# EAGLE schematic stm32f303 (EAGLE 7.7.0)

## Sheet 1 of 3: Controller
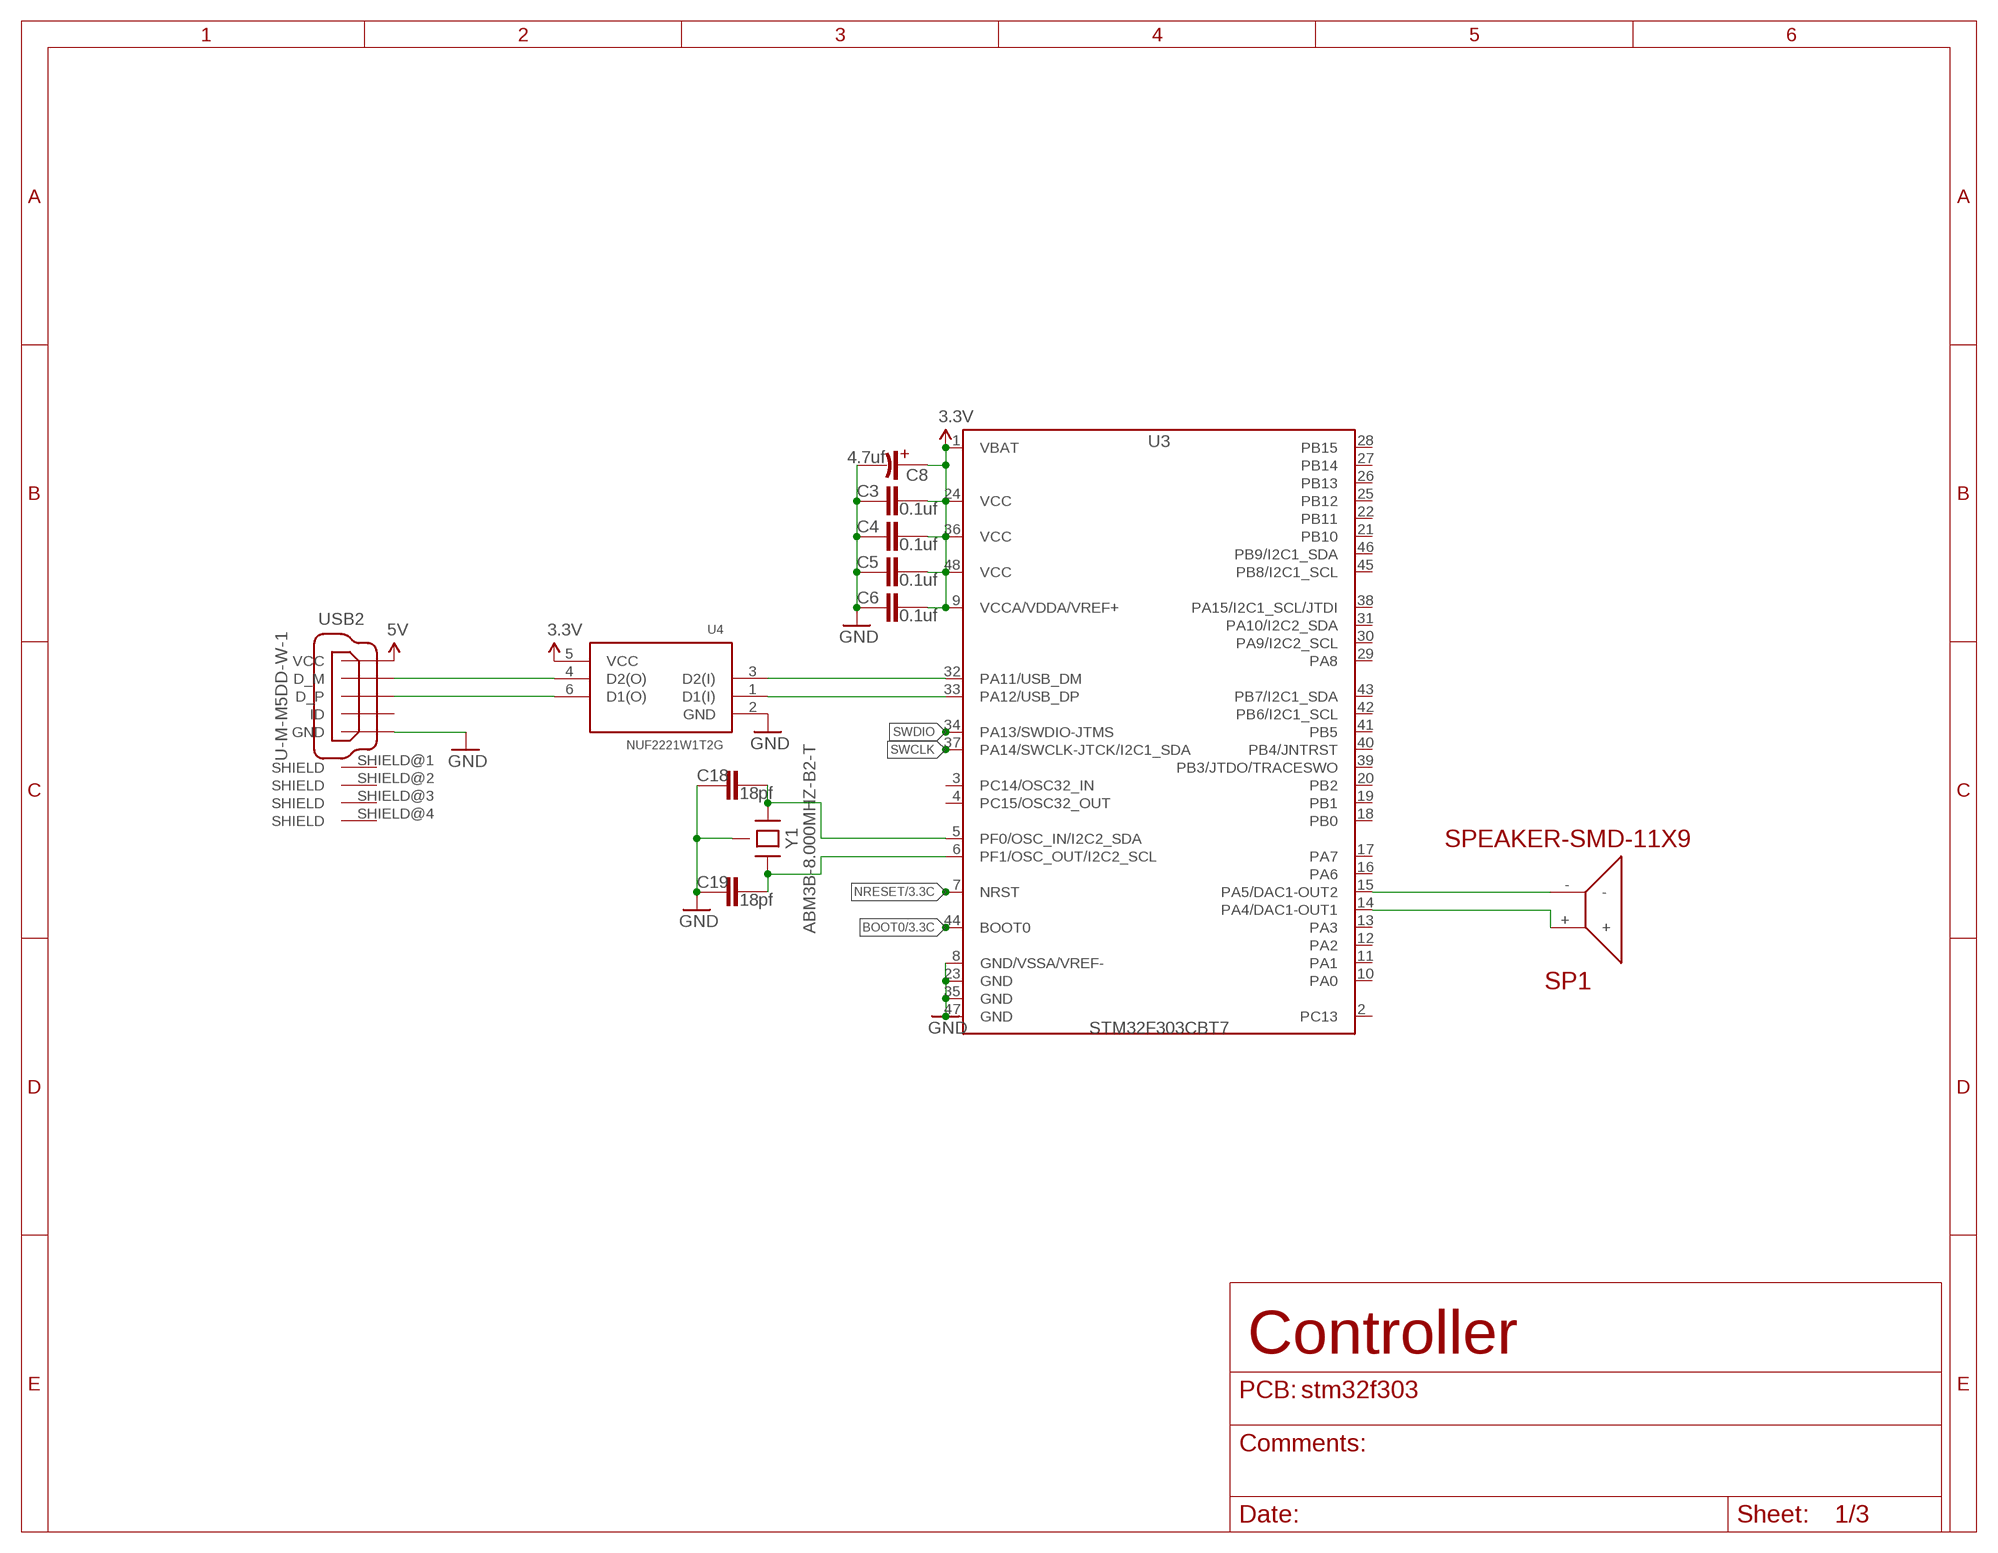
[diagram p0: schematic, sheet 1]

### Parts
C3  0.1uf  CAPACITOR-0402  [C0402]
C4  0.1uf  CAPACITOR-0402  [C0402]
C5  0.1uf  CAPACITOR-0402  [C0402]
C6  0.1uf  CAPACITOR-0402  [C0402]
C8  4.7uf  CAPACITOR-TANT-0805  [C0805-TANT]
C18  18pf  CAPACITOR-0402  [C0402]
C19  18pf  CAPACITOR-0402  [C0402]
SP1  SPEAKER-SMD-11X9  [AST1109MLTRQ]
U3  STM32F303CBT7  [LQFP48]
U4  NUF2221W1T2G  NUF221W1  [SOT-363]
USB2  U-M-M5DD-W-1  USB_CONN-LCSC  [U-M-M5DD-W-1]
Y1  ABM3B-8.000MHZ-B2-T  CRYSTAL-4PIN-3.2X5  [CRYSTAL-3.2X5]

### Nets
3.3V: C3.2 C4.2 C5.2 C6.2 C8.1(+) U3.1(VBAT) U3.9(VCCA/VDDA/VREF+) U3.24(VCC) U3.36(VCC) U3.48(VCC) U4.5(VCC) ; also sheet 2,3
5V: USB2.VCC ; also sheet 2
BOOT0: U3.44(BOOT0) ; also sheet 3
GND: C3.1 C4.1 C5.1 C6.1 C8.2(-) C18.1 C19.1 U3.8(GND/VSSA/VREF-) U3.23(GND) U3.35(GND) U3.47(GND) U4.2(GND) USB2.GND Y1.2(GND) Y1.4(GND) ; also sheet 2,3
N$1: U4.4(D2(O)) USB2.D-(D_M)
N$2: U4.6(D1(O)) USB2.D+(D_P)
N$10: SP1.- U3.15(PA5/DAC1-OUT2)
N$11: SP1.+ U3.14(PA4/DAC1-OUT1)
N$146: C18.2 U3.5(PF0/OSC_IN/I2C2_SDA) Y1.3
N$147: C19.2 U3.6(PF1/OSC_OUT/I2C2_SCL) Y1.1
NRESET: U3.7(NRST) ; also sheet 3
SWCLK: U3.37(PA14/SWCLK-JTCK/I2C1_SDA)
SWDIO: U3.34(PA13/SWDIO-JTMS)
U1_USB_N: U3.32(PA11/USB_DM) U4.3(D2(I))
U1_USB_P: U3.33(PA12/USB_DP) U4.1(D1(I))
Unconnected: U3.2(PC13) U3.3(PC14/OSC32_IN) U3.4(PC15/OSC32_OUT) U3.10(PA0) U3.11(PA1) U3.12(PA2) U3.13(PA3) U3.16(PA6) U3.17(PA7) U3.18(PB0) U3.19(PB1) U3.20(PB2) U3.21(PB10) U3.22(PB11) U3.25(PB12) U3.26(PB13) U3.27(PB14) U3.28(PB15) U3.29(PA8) U3.30(PA9/I2C2_SCL) U3.31(PA10/I2C2_SDA) U3.38(PA15/I2C1_SCL/JTDI) U3.39(PB3/JTDO/TRACESWO) U3.40(PB4/JNTRST) U3.41(PB5) U3.42(PB6/I2C1_SCL) U3.43(PB7/I2C1_SDA) U3.45(PB8/I2C1_SCL) U3.46(PB9/I2C1_SDA) USB2.ID USB2.SHIELD@1(SHIELD) USB2.SHIELD@2(SHIELD) USB2.SHIELD@3(SHIELD) USB2.SHIELD@4(SHIELD)

### Notes on the sheet
- Controller

## Sheet 2 of 3: Power
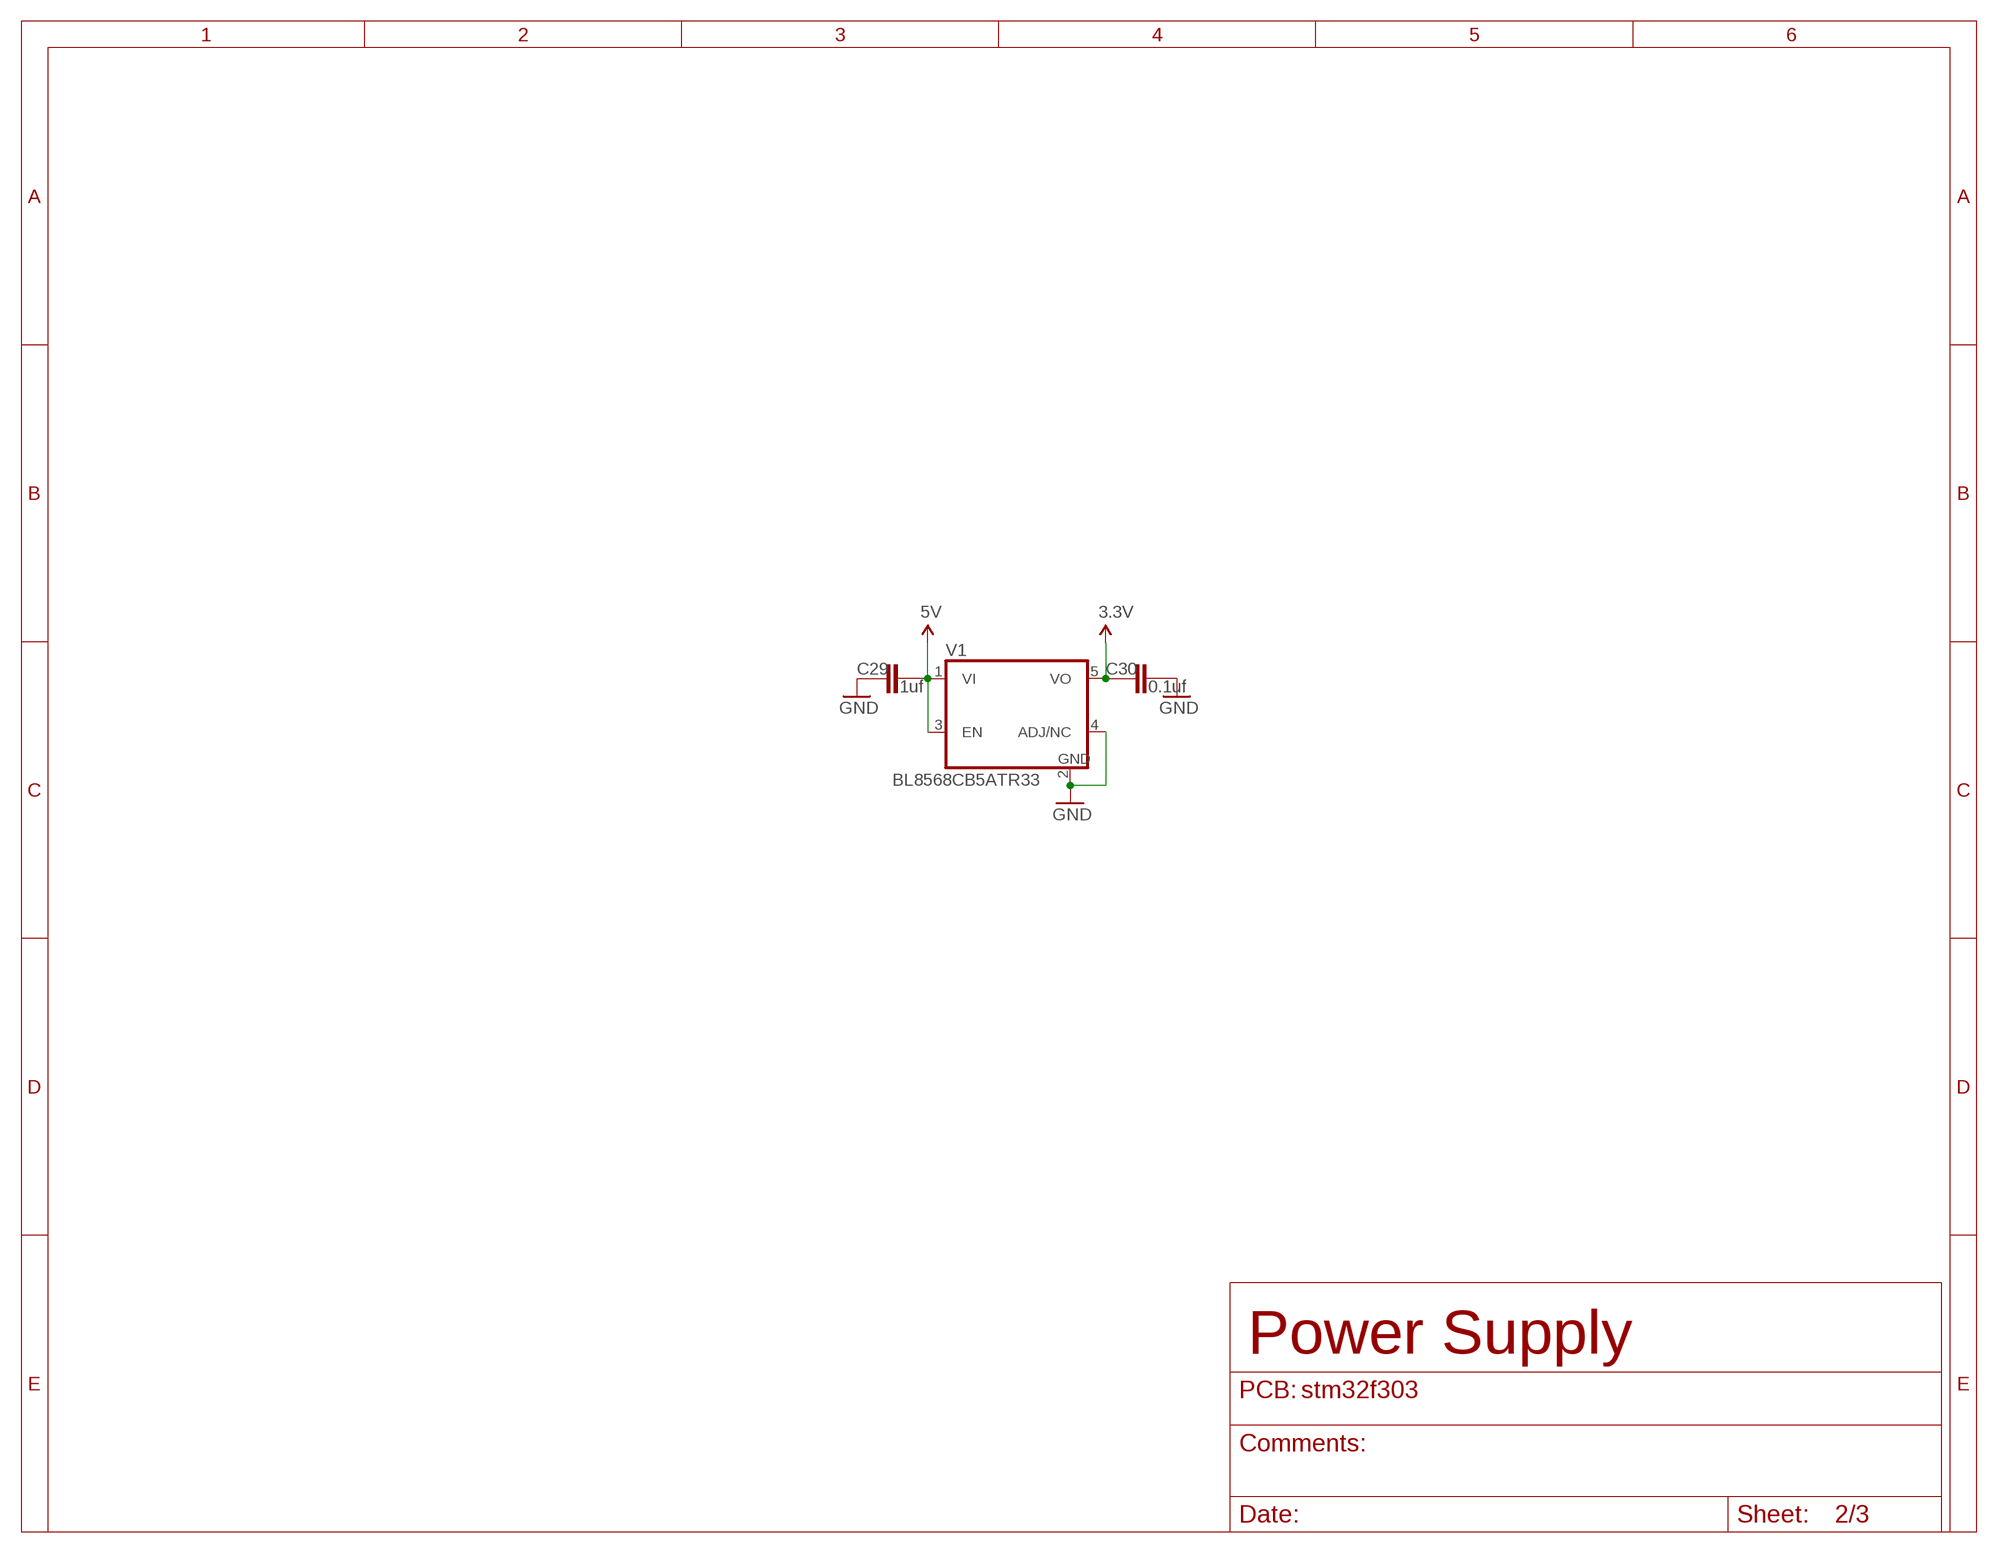
[diagram p1: schematic, sheet 2]

### Parts
C29  1uf  CAPACITOR-0402  [C0402]
C30  0.1uf  CAPACITOR-0402  [C0402]
V1  BL8568CB5ATR33  LDO-VR  [SOT-23-5]

### Nets
3.3V: C30.1 V1.5(VO) ; also sheet 1,3
5V: C29.2 V1.1(VI) V1.3(EN) ; also sheet 1
GND: C29.1 C30.2 V1.2(GND) V1.4(ADJ/NC) ; also sheet 1,3

### Notes on the sheet
- Power Supply

## Sheet 3 of 3: RESET
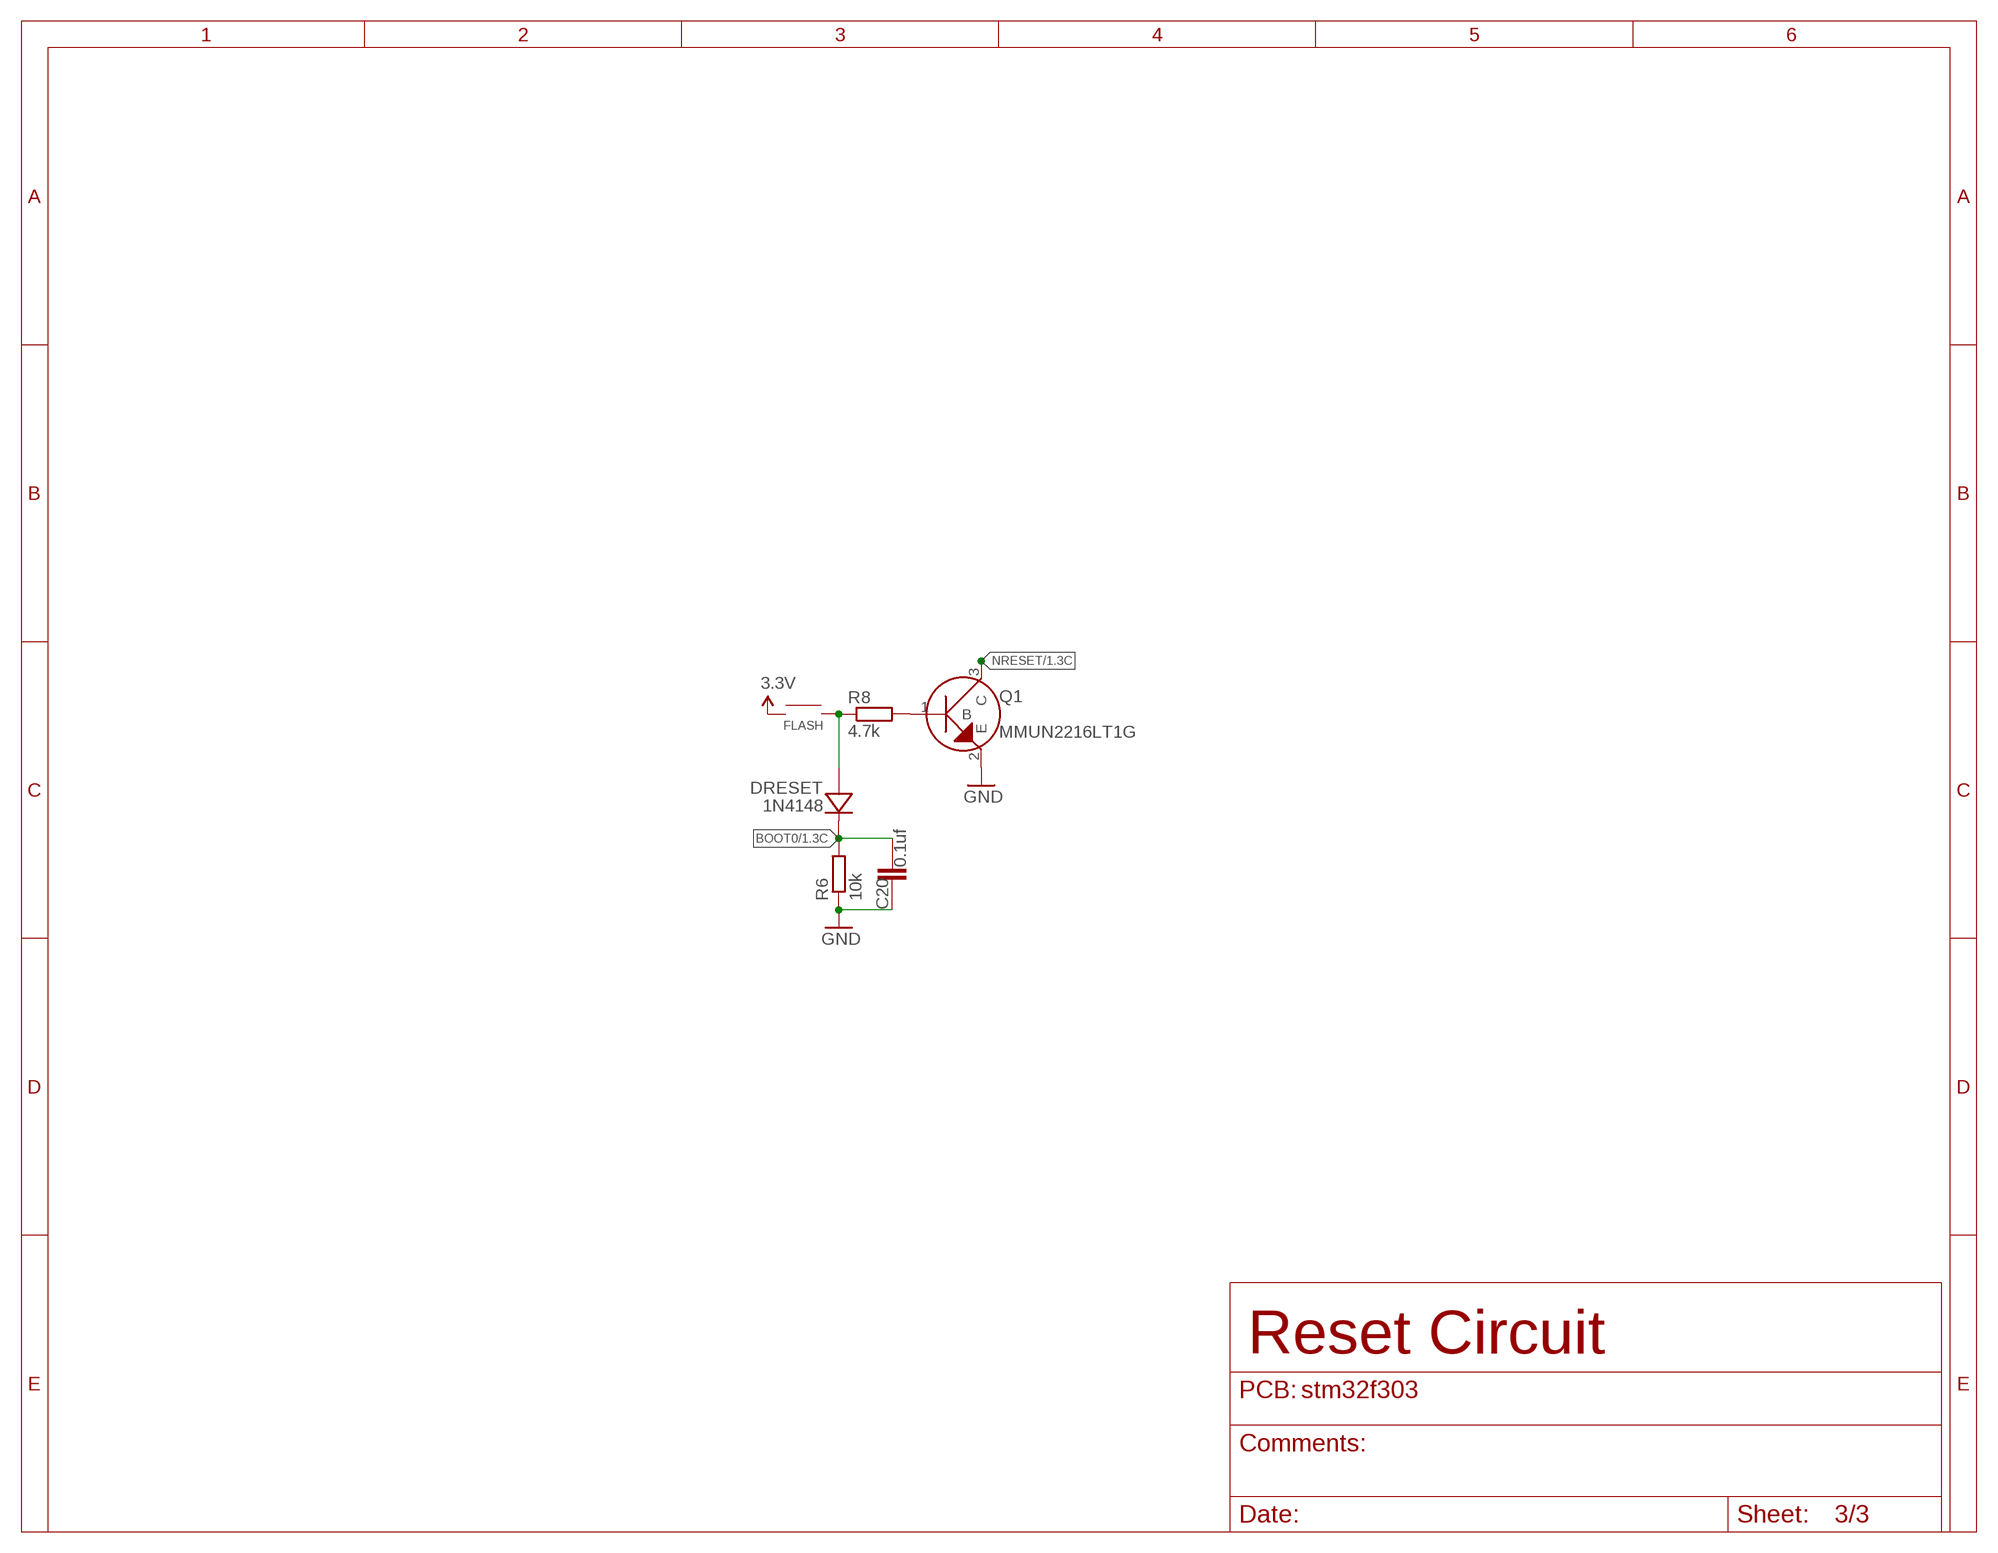
[diagram p2: schematic, sheet 3]

### Parts
C20  0.1uf  CAPACITOR-0402  [C0402]
DRESET  1N4148  DIODE-SOD-123  [SOD-123]
FLASH  SKRPABE010  SWITCH-SMD-SKRPABE010  [SWITCH-SMD-SKRPABE010]
Q1  MMUN2216LT1G  TRANSISTOR-NPN  [SOT-23-3]
R6  10k  RESISTOR-0405  [R0402]
R8  4.7k  RESISTOR-0405  [R0402]

### Nets
3.3V: FLASH.1A FLASH.1B ; also sheet 1,2
BOOT0: C20.2 DRESET.C R6.2 ; also sheet 1
FLASH: DRESET.A FLASH.2A FLASH.2B R8.1
GND: C20.1 Q1.2(E) R6.1 ; also sheet 1,2
N$80: Q1.1(B) R8.2
NRESET: Q1.3(C) ; also sheet 1

### Notes on the sheet
- Reset Circuit

## Library data of the parts
C3-C6 C18-C20 C29 C30 = Components:CAPACITOR
C8 = Components:CAPACITOR-TANT
DRESET = Components:DIODE: Standard 1N4148 diode
FLASH = Hardware:SWITCH-SMD
Q1 = Components:TRANSISTOR-NPN
R6 R8 = Components:RESISTOR
SP1 = Components:SPEAKER
U3 = MCU:STM32F303CBT7
U4 = ICs:NUF221W1
USB2 = USB:USB_CONN
V1 = Controller:LDO-VR: LDO Voltage Regulator
Y1 = Components:CRYSTAL-4PIN

## Net classes
1 PLUG_USB: width 0.25 mm, drill 0.25 mm, clearance 0.2 mm
3 VCC: width 0.25 mm, drill 0.25 mm, clearance 0.15 mm